# EasyEDA Pro project ProProject_智能车越野组英飞凌主板_2023-12-23.epro, board PCB1_1
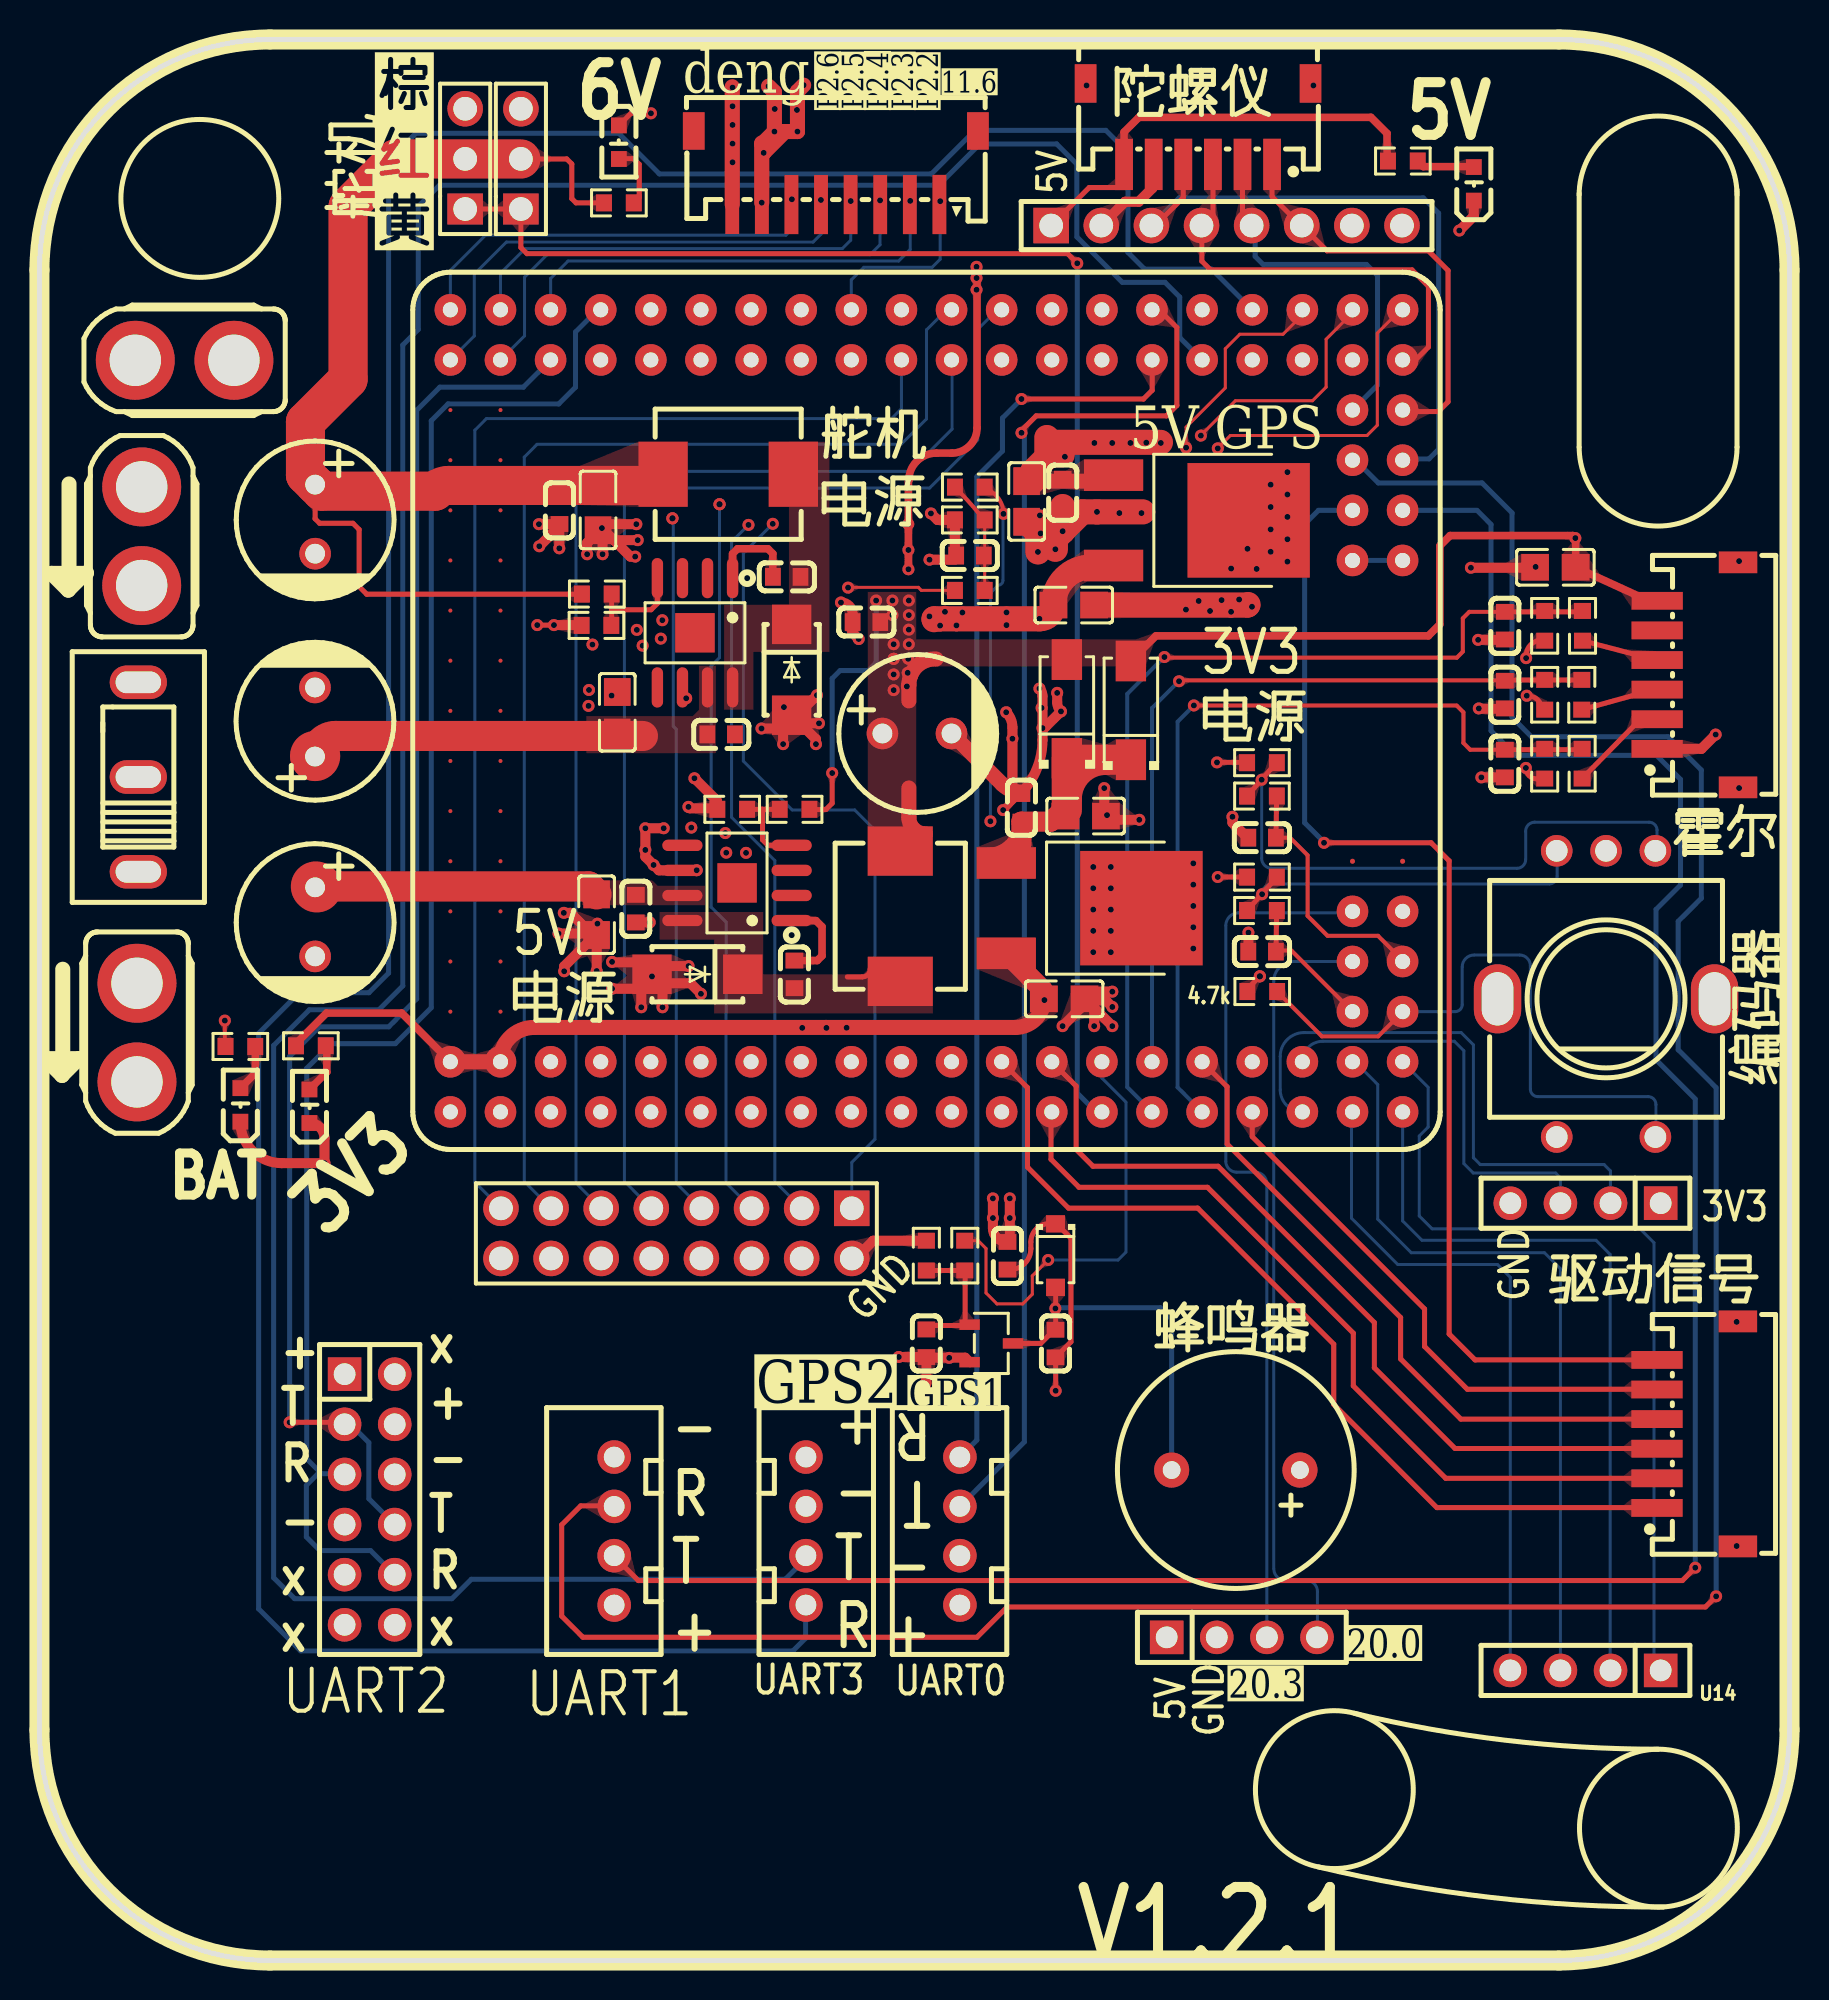
[diagram p4: board, top side]
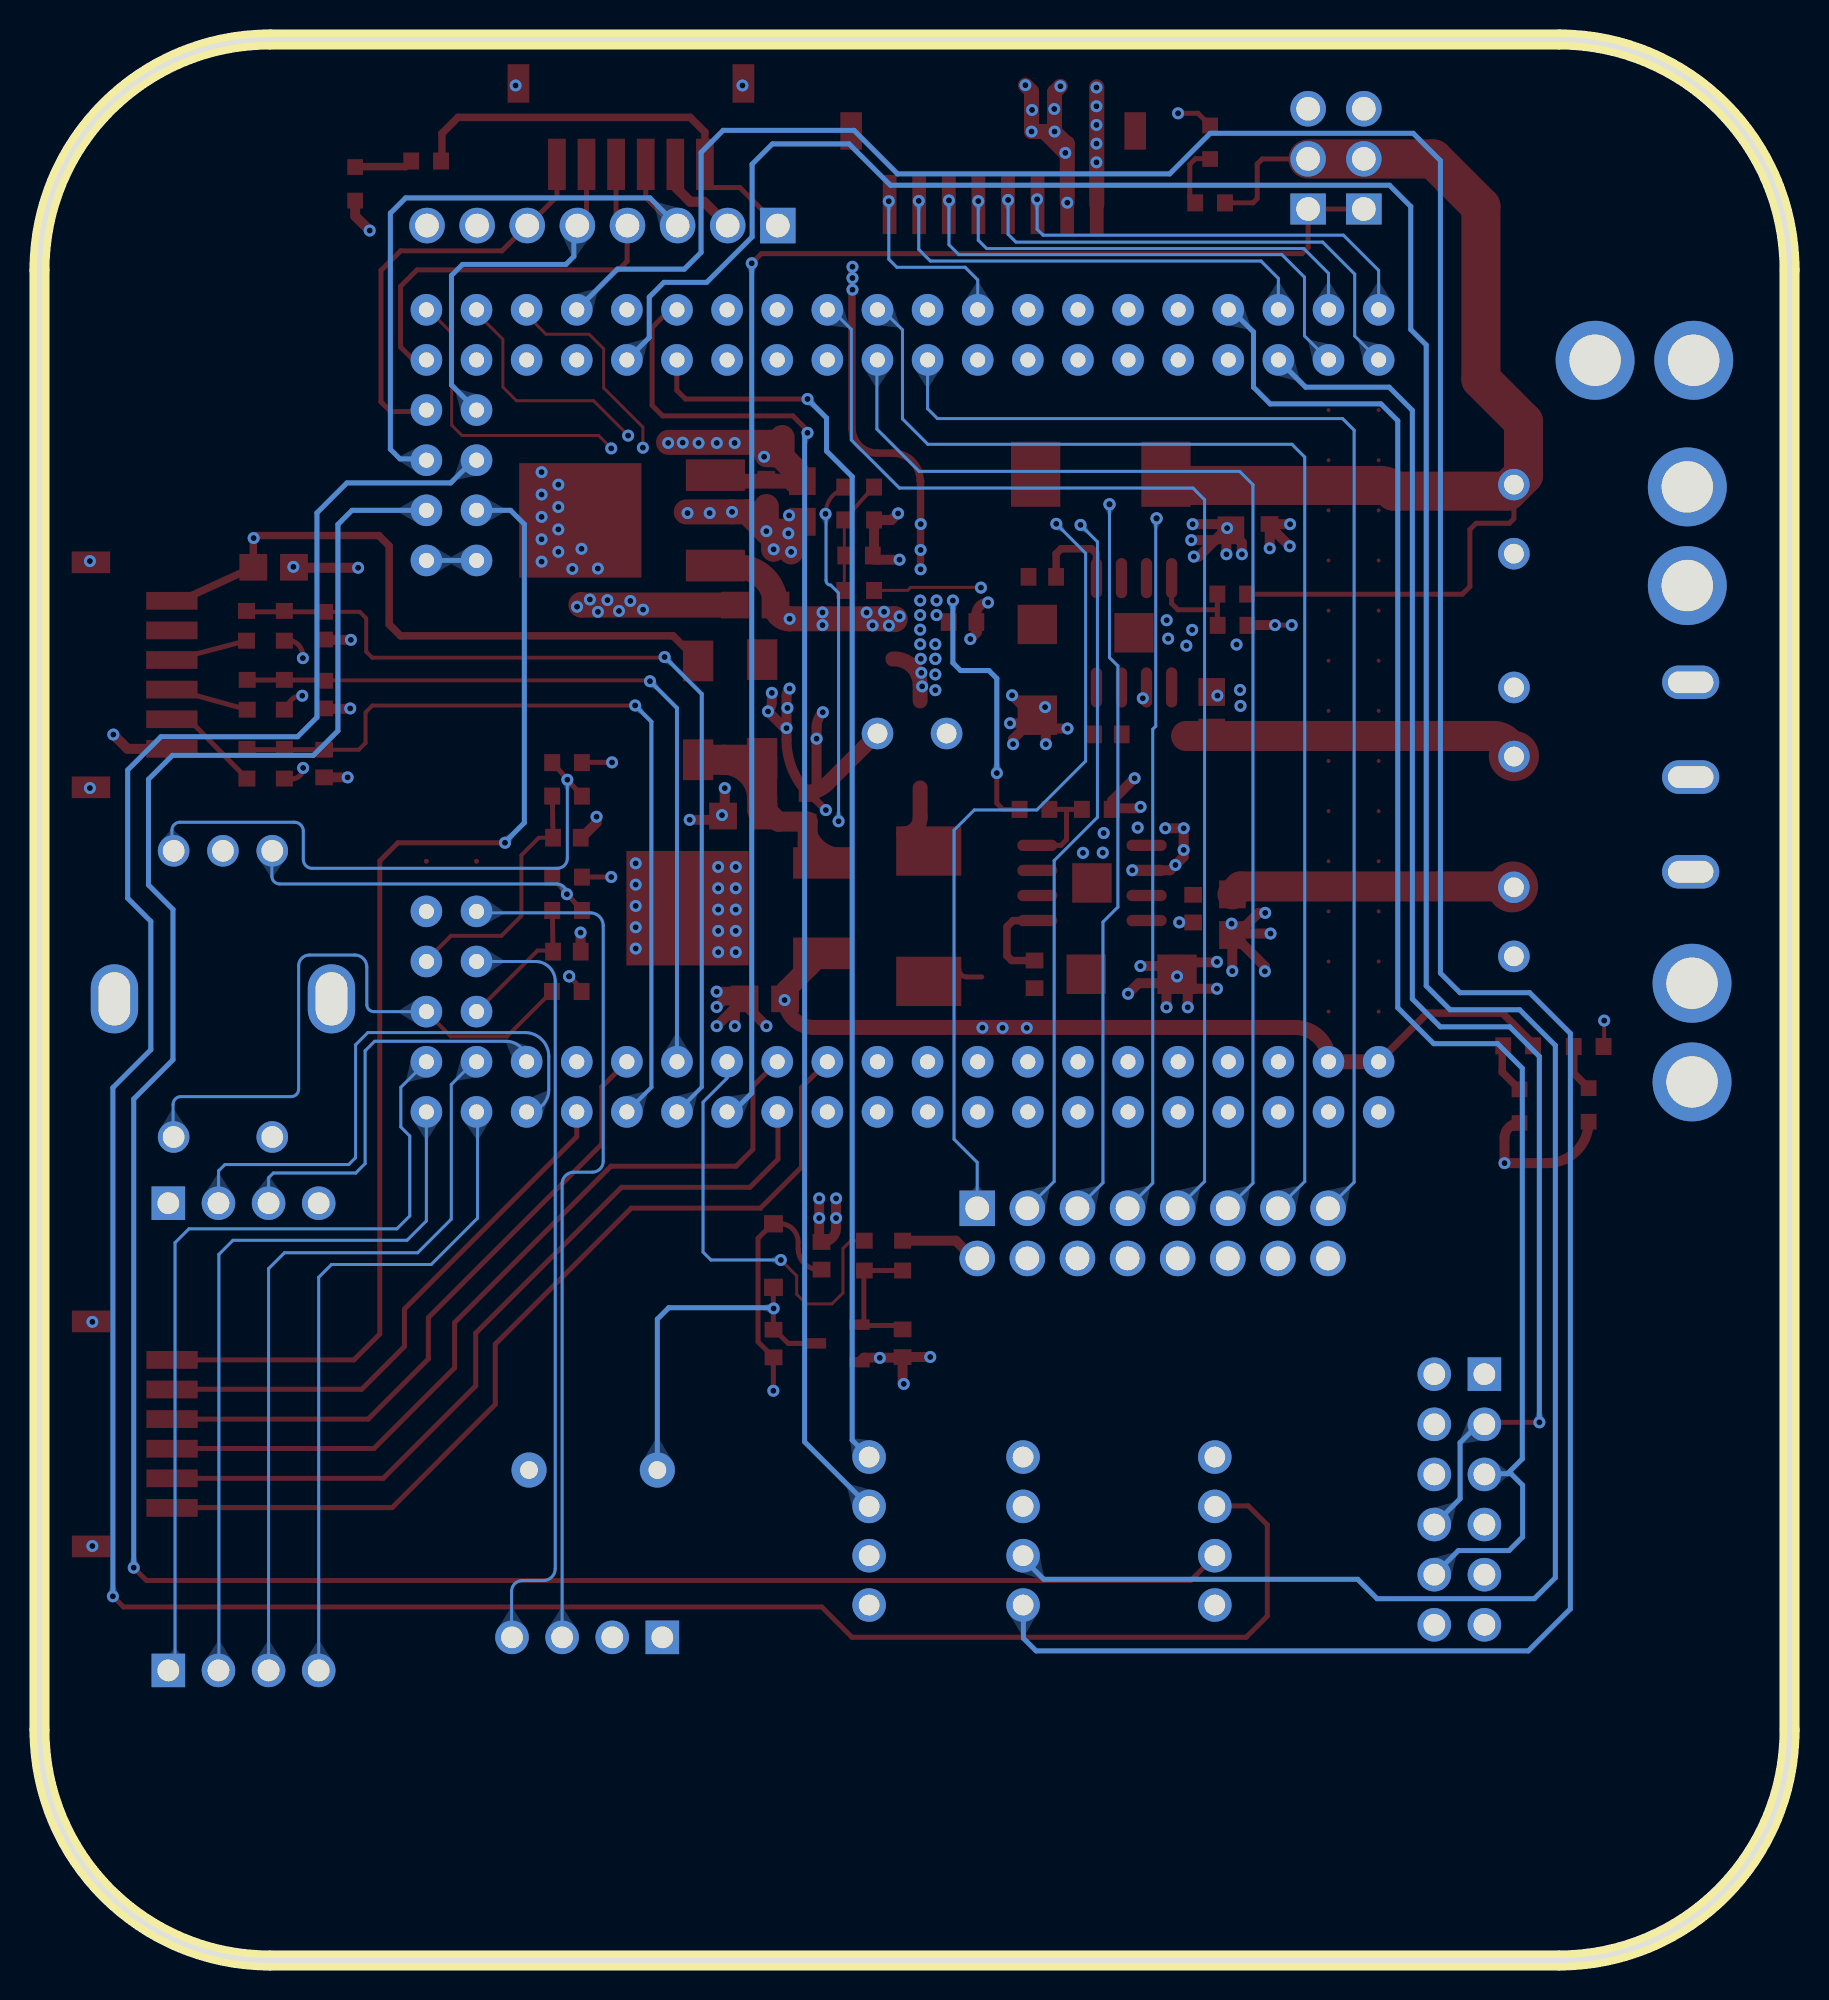
[diagram p5: board, bottom side, seen from below]

Outline 88.69 x 97.33 mm; copper layers: Top Layer, Inner1, Inner2, Bottom Layer. Coordinates in mm from the lower left corner of the outline.
Outline path: 0,85.65 0,11.68 arc(3.42,3.42) 11.68,0 77.01,0 arc(85.27,3.42) 88.69,11.68 88.69,85.65 arc(85.27,93.91) 77.01,97.33 11.68,97.33 arc(3.42,93.91) 0,85.65
Stack: Top Layer 0.035mm / Dielectric1 0.48mm PP er 4.5 / Inner1 0.035mm / Dielectric2 0.48mm FR4 er 4.5 / Inner2 0.035mm / Dielectric3 0.48mm PP er 4.5 / Bottom Layer 0.035mm

## Design rules (mm)
template: 自定义配置
spacing copperThickness1oz (default): track to track 0.102, other pairs 0 to 0.3
spacing copperThickness2oz: track to track 0.203, other pairs 0.152 to 0.3
spacing copperThicknessInner0.5oz: track to track 0.089, other pairs 0.152 to 0.3
track width copperThickness1oz (default): min 0.102, default 0.254, max 2.54
track width copperThickness2oz: min 0.203, default 0.254, max 2.54
track width copperThickness0.5oz: min 0.089, default 0.254, max 2.54
differential pair differentialPair (default): width min 0.127, default 0.254, max 2.54; gap min 0.152, default 0.152
via viaSize (default): diameter min 0.3, default 0.61, max 10; hole min 0.201, default 0.305, max 6.299
pour e3495 uses zhilian
pour e3982 uses zhilian
pour e4006 uses zhilian
pour e199 uses zhilian
pour e201 uses zhilian
pour e1502 uses zhilian
pour e1487 uses zhilian

## Placement (name value [footprint] x y rotation side)
BUZZER1  2048Hz  [BUZ-TH_BD12.0-P6.50-D0.6-FD]  60.63 24.85 180 top
C1  470uF  [CAP-TH_BD8.0-P3.50-D0.6-FD_1]  13.96 62.75 90 top
C2  10uF  [C0805]  28.31 73.5 270 top
C4  10nF  [C0603]  38.26 49.97 90 top
C5  10uF  [C0805]  28.24 52.99 90 top
C6  220uF  [CAP-TH_BD8.0-P3.50-D0.6-FD_1]  44.47 62.17 0 top
C7  100nF  [C0603]  30.23 53.3 90 top
C8  100nF  [C0603]  41.91 67.82 0 top
C9  10uF  [C0805]  53.02 57.99 0 top
C10  100nF  [C0603_1]  49.76 58.4 270 top
C12  470uF  [CAP-TH_BD8.0-P3.50-D0.6-FD_1]  13.97 52.63 270 top
C13  100nF  [C0603]  47.16 71.19 0 top
C14  10nF  [C0603]  61.97 56.89 0 top
C15  100nF  [C0603_2]  51.49 31.26 270 top
C19  10nF  [C0603]  74.27 64.14 90 top
C20  10nF  [C0603]  74.27 60.65 90 top
C22  10nF  [C0603]  37.87 70.11 180 top
C23  10uF  [C0805]  76.83 70.59 180 top
C24  10uF  [C0805]  29.28 63.24 270 top
C30  100nF  [C0603_2]  44.95 31.28 90 top
C31  100nF  [C0603_2]  49.06 35.71 90 top
C33  220uF  [CAP-TH_BD8.0-P3.50-D0.6-FD_1]  13.97 73.03 270 top
C34  100nF  [C0603]  34.55 62.13 180 top
C35  100nF  [C0603]  26.35 73.48 90 top
C38  10nF  [C0603]  61.97 51.12 0 top
C39  10nF  [C0603]  74.27 67.63 90 top
C40  10uF  [C0805]  51.93 48.73 0 top
C41  100nF  [C0603_1]  51.86 74.38 90 top
C42  10uF  [C0805]  50.03 73.93 270 top
C43  10uF  [C0805]  52.42 68.68 0 top
CN1  XT30UPB-F  [CONN-TH_XT30UPB-F]  7.36 81.08 180 top
CN2  KH-ZH1.5WF-06A  [CONN-SMD_KH-ZH1.5WF-06A]  84.04 65.14 90 top
CN4  KH-ZH1.5WF-06A  [CONN-SMD_KH-ZH1.5WF-06A]  84.03 26.68 90 top
CN6  KH-ZH1.5WF-06A  [CONN-SMD_KH-ZH1.5WF-06A]  58.72 93.05 180 top
CN7  XT30UPB-F  [CONN-TH_XT30UPB-F]  5.18 72.17 90 top
CN8  XT30UPB-F  [CONN-TH_XT30UPB-F]  4.94 47.02 270 top
D3  SS34  [DO-214AC_L4.3-W2.7-LS5.3-RD]  33.35 49.97 180 top
D4  SS54  [SMA_L4.4-W2.8-LS5.4-R-RD]  55.31 63.34 90 top
D5  -  [SOD-123_L2.7-W1.6-LS3.7-RD]  51.5 35.72 270 top
D6  SS34  [DO-214AC_L4.3-W2.7-LS5.3-RD]  38.12 65.4 270 top
D9  SS54  [SMA_L4.4-W2.8-LS5.4-R-RD]  52.07 63.41 90 top
H2  icm20602  [HDR-TH_8P-P2.54-V-F-1]  60.16 87.91 0 top
H3  舵机输入  [HDR-TH_3P-P2.54-V-M-1]  24.4 91.28 90 top
H5  舵机输入  [HDR-TH_3P-P2.54-V-M-1]  21.57 91.28 90 top
H6  -  [HDR-TH_16P-P2.54-V-M-R2-C8-S2.54]  32.28 36.84 180 top
H9  2.54-2*6P母  [HDR-TH_12P-P2.54-V-F-R2-C6-S2.54]  16.73 23.36 270 top
H16  -  [HDR-TH_4P-P2.54-V-F]  60.94 16.37 0 top
L1  15uH  [IND-SMD_L7.4-W6.6]  34.91 75.31 0 top
L2  15uH  [IND-SMD_L7.4-W6.6]  43.63 52.91 270 top
LED1  KT-0603R  [LED0603-R-RD]  13.68 43.29 90 top
LED2  KT-0603R  [LED0603-R-RD]  10.18 43.35 90 top
LED3  KT-0603R  [LED0603-R-RD]  29.37 92.13 270 top
LED4  KT-0603R  [LED0603-R-RD]  72.69 90.02 90 top
P1  陀螺仪  [CONN-TH_4P-P2.50-XH2.54-4P]  46.65 21.76 270 top
P2  陀螺仪  [CONN-TH_4P-P2.50-XH2.54-4P]  29.13 21.76 270 top
P3  陀螺仪  [CONN-TH_4P-P2.50-XH2.54-4P]  38.85 21.76 90 top
P5  SMD_ZH1.5MM-8P  [CONN-SMD_8P-P1.50_HCTL_HC-ZH-8PWT]  40.36 90.84 180 top
Q1  -  [SOT-23-3_L3.0-W1.7-P0.95-LS2.9-BR]  48.24 31.27 180 top
R1  10k  [R0603]  61.96 59 180 top
R2  6.8kΩ  [R0603]  38.27 58.33 0 top
R3  10k  [R0603]  13.76 46.35 0 top
R4  10k  [R0603]  10.18 46.31 0 top
R5  10k  [R0603]  29.37 89.06 0 top
R6  10k  [R0603]  69.1 91.18 0 top
R7  10k  [R0603]  61.96 53.2 180 top
R8  6.8kΩ  [R0603]  28.25 69.23 180 top
R9  1.74kΩ  [R0603]  28.23 67.65 0 top
R10  2.2kΩ  [R0603]  35.11 58.33 0 top
R11  10k  [R0603]  61.96 54.89 180 top
R12  10k  [R0603]  61.96 60.69 180 top
R13  47k  [R0603]  47.15 69.42 0 top
R14  10k  [R0603]  47.15 72.99 180 top
R17  10k  [R0603_3]  44.95 35.72 270 top
R18  1k  [R0603_3]  46.9 35.72 270 top
R19  100  [R0603]  47.15 74.65 180 top
R22  4.7k  [R0603]  76.29 67.63 270 top
R23  4.7k  [R0603]  76.29 64.13 270 top
R25  4.7k  [R0603]  76.29 60.64 270 top
R26  100  [R0603]  78.2 67.63 270 top
R27  100  [R0603]  78.17 64.13 270 top
R30  100  [R0603]  78.19 60.64 270 top
R31  0603WAF4701T5E  [R0603]  61.97 49.1 180 top
SW1  EC11L1525E05  [SW-TH_EC11L1525E05]  79.4 48.98 180 top
U1  TC264_CoreBoard  [TC系列V0.2]  73.66 64.21 180 top
U2  LM29150RS-3.3  [TO-252-2_L6.6-W6.1-P4.57-LS9.9-BR-CW]  52.42 53.32 180 top
U3  TPS5430DDAR  [SOIC-8_L5.0-W4.0-P1.27-LS6.0-BL-EP2.0]  35.35 54.6 90 top
U7  TPS5430DDAR  [SOIC-8_L5.0-W4.0-P1.27-LS6.0-BL-EP2.0]  33.22 67.27 180 top
U13  HX SS12D10G4  [SW-TH_SHOU-HAN_SS12D10G4]  5.01 59.96 90 top
U14  -  [5个按键C]  76.83 32.95 270 top
U15  LM29150RS-3.3  [TO-252-2_L6.6-W6.1-P4.57-LS9.9-BR-CW]  57.86 72.97 180 top

## Footprints (pads in the part's own frame, mm; a bottom-side part is the same pattern mirrored in y, then rotated)
5个按键C
  rect 1.7x1.7 hole 1.1: 1(18.253,5.334) 2(-5.42,5.334)
  round 1.7 hole 1.1: 3(-5.42,0.254) 4(18.253,-2.286) 5(-5.42,2.794) 6(18.253,2.794) 7(18.253,0.254) 8(-5.42,-2.286)
BUZ-TH_BD12.0-P6.50-D0.6-FD
  round 1.778 hole 0.899: 1(-3.251,0) 2(3.251,0)
C0603
  rect 0.8x0.9 smd: 1(-0.7,0) 2(0.7,0)
C0603_1
  rect 0.8x0.9 smd: 1(-0.7,0) 2(0.7,0)
C0603_2
  rect 0.8x0.9 smd: 1(-0.7,0) 2(0.7,0)
C0805
  rect 1.409x1.351 smd: 1(-1.028,0) 2(1.031,0)
CAP-TH_BD8.0-P3.50-D0.6-FD_1
  round 1.6 hole 1: 1(-1.75,0) 2(1.75,0)
CONN-SMD_8P-P1.50_HCTL_HC-ZH-8PWT
  rect 0.7x3 smd: 1(-5.25,1.863) 2(-3.75,1.863) 3(-2.25,1.863) 4(-0.75,1.863) 5(0.75,1.863) 6(2.25,1.863) 7(3.75,1.863) 8(5.25,1.863)
  rect 1.1x1.9 smd: 9(7.2,-1.863) 10(-7.2,-1.863)
CONN-SMD_KH-ZH1.5WF-06A
  rect 0.9x2.6 smd: 1(-3.75,2.05) 2(-2.25,2.05) 3(-0.75,2.05) 4(0.75,2.05) 5(2.25,2.05) 6(3.75,2.05)
  rect 1.1x1.95 smd: 7(5.7,-2.05) 8(-5.7,-2.05)
CONN-TH_4P-P2.50-XH2.54-4P
  round 1.7 hole 1.049: 1(3.749,0) 2(1.25,0) 3(-1.25,0) 4(-3.749,0)
CONN-TH_XT30UPB-F
  round 4 hole 2.601: 1(-2.499,0) 2(2.499,0)
DO-214AC_L4.3-W2.7-LS5.3-RD
  rect 1.999x1.999 smd: 1(-2.299,0) 2(2.301,0)
HDR-TH_3P-P2.54-V-M-1
  rect 1.575x1.801 hole 1.199: 1(-2.54,0)
  round 1.801 hole 1.199: 2(0,0) 3(2.54,0)
HDR-TH_4P-P2.54-V-F
  rect 1.7x1.7 hole 1.1: 1(-3.81,0)
  round 1.7 hole 1.1: 2(-1.27,0) 3(1.27,0) 4(3.81,0)
HDR-TH_8P-P2.54-V-F-1
  rect 1.801x1.801 hole 1.199: 1(-8.89,0)
  round 1.801 hole 1.199: 2(-6.35,0) 3(-3.81,0) 4(-1.27,0) 5(1.27,0) 6(3.81,0) 7(6.35,0) 8(8.89,0)
HDR-TH_12P-P2.54-V-F-R2-C6-S2.54
  rect 1.7x1.7 hole 1.1: 1(-6.35,-1.27)
  round 1.7 hole 1.1: 2(-6.35,1.27) 3(-3.81,-1.27) 4(-3.81,1.27) 5(-1.27,-1.27) 6(-1.27,1.27) 7(1.27,-1.27) 8(1.27,1.27) 9(3.81,-1.27) 10(3.81,1.27) 11(6.35,-1.27) 12(6.35,1.27)
HDR-TH_16P-P2.54-V-M-R2-C8-S2.54
  rect 1.8x1.8 hole 1.2: 1(-8.89,-1.27)
  round 1.8 hole 1.2: 2(-8.89,1.27) 3(-6.35,-1.27) 4(-6.35,1.27) 5(-3.81,-1.27) 6(-3.81,1.27) 7(-1.27,-1.27) 8(-1.27,1.27) 9(1.27,-1.27) 10(1.27,1.27) 11(3.81,-1.27) 12(3.81,1.27) 13(6.35,-1.27) 14(6.35,1.27) 15(8.89,-1.27) 16(8.89,1.27)
IND-SMD_L7.4-W6.6
  rect 2.499x3.3 smd: 1(-3.302,0) 2(3.302,0)
LED0603-R-RD
  rect 0.8x0.8 smd: 1(0.851,0) 2(-0.851,0)
R0603
  rect 0.807x0.864 smd: 1(-0.754,0) 2(0.754,0)
R0603_3
  rect 0.807x0.864 smd: 1(-0.754,0) 2(0.754,0)
SMA_L4.4-W2.8-LS5.4-R-RD
  rect 2.062x1.539 smd: 1(2.503,0) 2(-2.503,0)
SOD-123_L2.7-W1.6-LS3.7-RD
  rect 0.879x0.96 smd: 1(-1.611,0) 2(1.611,0)
SOIC-8_L5.0-W4.0-P1.27-LS6.0-BL-EP2.0
  oval 0.574x2.037 smd: 1(-1.905,-2.768) 2(-0.635,-2.768) 3(0.635,-2.768) 4(1.905,-2.768) 5(1.905,2.768) 6(0.635,2.768) 7(-0.635,2.768) 8(-1.905,2.768)
  rect 1.999x1.999 smd: 9(0,0)
SOT-23-3_L3.0-W1.7-P0.95-LS2.9-BR
  rect 1.036x0.531 smd: 1(1.103,-0.95) 2(1.103,0.95) 3(-1.103,0)
SW-TH_EC11L1525E05
  oval 2.4x3.5 hole 1.6x2.7: 6(-5.5,0.25) 7(5.5,0.25)
  round 1.6 hole 1.1: A(-2.5,-7.25) B(2.5,-7.25) C(0,-7.25) D(-2.5,7.25) E(2.5,7.25)
SW-TH_SHOU-HAN_SS12D10G4
  oval 1.7x2.9 hole 1.1x2.3: 1(-4.8,0) 2(0,0) 3(4.8,0)
TC系列V0.2
  round 1.6 hole 0.762: 1(52.832,21.209) 2(52.832,18.669) 3(50.292,21.209) 4(50.292,18.669) 5(47.752,21.209) 6(47.752,18.669) 7(45.212,21.209) 8(45.212,18.669) 9(42.672,21.209) 10(42.672,18.669) 11(40.132,21.209) 12(40.132,18.669) 13(37.592,21.209) 14(37.592,18.669) 15(35.052,21.209) 16(35.052,18.669) 17(32.512,21.209) 18(32.512,18.669) 19(29.972,21.209) 20(29.972,18.669) 21(27.432,21.209) 22(27.432,18.669) 23(24.892,21.209) 24(24.892,18.669) 25(22.352,21.209) 26(22.352,18.669) 27(19.812,21.209) 28(19.812,18.669) 29(17.272,21.209) 30(17.272,18.669) 31(14.732,21.209) 32(14.732,18.669) 33(12.192,21.209) 34(12.192,18.669) 35(9.652,21.209) 36(9.652,18.669) 37(7.112,21.209) 38(7.112,18.669) 39(4.572,21.209) 40(4.572,18.669) 41(4.572,16.129) 42(7.112,16.129) 43(4.572,13.589) 44(7.112,13.589) 45(4.572,11.049) 46(7.112,11.049) 49(7.112,-6.731) 50(4.572,-6.731) 51(7.112,-9.271) 52(4.572,-9.271) 53(7.112,-11.811) 54(4.572,-11.811) 55(7.112,-14.351) 56(4.572,-14.351) 57(4.572,-16.891) 58(4.572,-19.431) 59(7.112,-16.891) 60(7.112,-19.431) 61(9.652,-16.891) 62(9.652,-19.431) 63(12.192,-16.891) 64(12.192,-19.431) 65(14.732,-16.891) 66(14.732,-19.431) 67(17.272,-16.891) 68(17.272,-19.431) 69(19.812,-16.891) 70(19.812,-19.431) 71(22.352,-16.891) 72(22.352,-19.431) 73(24.892,-16.891) 74(24.892,-19.431) 75(27.432,-16.891) 76(27.432,-19.431) 77(29.972,-16.891) 78(29.972,-19.431) 79(32.512,-16.891) 80(32.512,-19.431) 81(35.052,-16.891) 82(35.052,-19.431) 83(37.592,-16.891) 84(37.592,-19.431) 85(40.132,-16.891) 86(40.132,-19.431) 87(42.672,-16.891) 88(42.672,-19.431) 89(45.212,-16.891) 90(45.212,-19.431) 91(47.752,-16.891) 92(47.752,-19.431) 93(50.292,-16.891) 94(50.292,-19.431) 95(52.832,-16.891) 96(52.832,-19.431)
  round 0.254 smd: 47(4.572,8.509) 48(7.112,8.509)
  round 0.203 smd: 97(50.292,-14.351) 98(52.832,-14.351) 99(50.292,-11.811) 100(52.832,-11.811) 101(50.292,-9.271) 102(52.832,-9.271) 103(50.292,-6.731) 104(52.832,-6.731) 105(50.292,-4.191) 106(52.832,-4.191) 107(50.292,-1.651) 108(52.832,-1.651) 109(50.292,0.889) 110(52.832,0.889) 111(50.292,3.429) 112(52.832,3.429) 113(50.292,5.969) 114(52.832,5.969) 115(50.292,8.509) 116(52.832,8.509) 117(50.292,11.049) 118(52.832,11.049) 119(50.292,13.589) 120(52.832,13.589) 121(50.292,16.129) 122(52.832,16.129)
TO-252-2_L6.6-W6.1-P4.57-LS9.9-BR-CW
  rect 3x1.6 smd: 1(3.424,-2.29) 3(3.424,2.29)
  rect 6.2x5.8 smd: 2(-3.424,0)

## Nets
As in the schematic, except:
3V3: C40.1 H6.4 R3.1 R11.2 R12.2 R22.2 R23.2 R25.2 R31.2 U1.2 U1.4 U2.3 U14.2
+5V: BUZZER1.1 C6.1 C8.2 C15.2 C23.1 C31.1 CN2.6 CN6.6 D4.1 D5.1 D9.1 H2.1 H9.1 H9.4 H16.1 L2.1 P2.1 R2.2 R6.1
+6V: C2.1 C33.1 C35.2 H3.2 H5.2 L1.1 R5.1 R8.2
GND: C1.2 C2.2 C5.1 C6.2 C7.1 C8.1 C9.2 C10.1 C12.2 C13.1 C14.1 C19.1 C20.1 C23.2 C24.1 C30.1 C31.2 C33.2 C34.1 C35.1 C38.1 C39.1 C40.2 C41.1 C42.2 C43.2 CN1.2 CN2.1 CN2.7 CN2.8 CN4.7 CN4.8 CN6.5 CN6.7 CN6.8 CN7.2 CN8.2 D3.2 D6.2 H2.2 H3.3 H5.3 H6.2 H9.6 H9.7 H16.2 LED1.2 LED2.2 LED3.2 LED4.2 P1.2 P2.4 P3.2 P5.7 Q1.2 R9.1 R10.1 R14.2 R17.1 SW1.6 SW1.7 SW1.C SW1.E U1.1 U1.3 U2.2 U3.6 U3.9 U7.6 U7.9 U14.8 U15.2
BAT: C41.2 C42.1 CN1.1 CN7.1 U13.2 U15.1
KEY1: U1.36 U14.3
KEY2: U1.37 U14.4
KEY3: U1.35 U14.5
KEY4: U1.39 U14.6
KEY5: U1.38 U14.7
KEY6: U1.40 U14.1

Pads without a net: CN2 5; H2 7 8; H9 2 9 11 12; P5 9 10; U1 5 6 7 8 10 12 14 16 18 21 45 47 48 69 70 71 72 73 88 89 97 98 107 108 109 110 111 112 113 114 115 116 117 118 119 120 121 122; U3 2 3 5; U7 2 3 5; U13 3

## Via types
v1: diameter 0.61, hole 0.305, Top Layer to Bottom Layer, 231 vias

## Routing (per net, layer and track width the routed paths; a pad name or vN(x,y) marks a point on that pad's centre or on a via; arc(x,y) is an arc through that point)
3V3: length 149.7
  Top Layer w0.254: 61.14,60.75 61.1,60.71 v1(59.68,60.71) ; R11.2 61.2,54.9 v1(59.72,54.9) ; 75.35,64.08 75.45,64.08 arc(75.93,63.87) 76.13,63.39 ; 61.23,48.98 61.23,49.25 v1(61.85,49.87) ; v1(39.88,47.25) 39.88,47.28 ; v1(75.35,65.99) 75.35,66.1 arc(75.58,66.67) 76.15,66.91 ; 76.15,59.87 75.89,59.87 arc(75.5,60.03) v1(75.33,60.43)
  Top Layer w0.381: 13.01,46.52 13.07,46.52 14.55,48 18.36,48 U1.2
  Top Layer w0.762: U1.2 23.32,45.54 arc(23.32,45.54) 23.32,45.53 ; 23.34,45.54 arc(23.85,46.77) 25.07,47.28 49.46,47.28 arc(50.48,47.7) C40.1
  Top Layer w1.016: U2.3 50.83,49.2 50.83,48.67
  Inner2 w0.254: 75.35,64.08 v1(75.35,65.99) ; v1(61.85,49.87) 61.38,49.4 60.45,49.4 arc(60.31,49.41) 60.17,49.45 ; 59.69,54.92 59.69,61.61 arc(59.95,62.24) 60.58,62.51 71.15,62.51 ; 59.69,54.92 59.69,50.36 ; 59.69,54.92 arc(59.7,54.91) v1(59.72,54.9) 59.69,54.9 59.69,54.89 ; 59.69,50.36 59.69,50.17 ; 59.69,50.36 arc(59.49,49.88) 59.01,49.68 ; 59.69,50.17 59.69,49.68 ; 59.69,50.17 arc(59.75,49.86) 59.93,49.61 ; 59.69,49.68 59.71,49.68 arc(59.82,49.66) 59.93,49.61 ; 59.69,49.68 59.69,49.36 ; 59.69,49.68 59.01,49.68 ; 74.93,62.49 75.33,62.49 ; 74.93,62.49 74.86,62.49 ; 74.93,62.49 arc(75.21,62.6) 75.33,62.89 ; 75.33,62.49 75.33,62.02 ; 75.33,62.49 75.33,62.89 ; 60.17,49.45 60.14,49.45 arc(59.82,49.32) 59.69,49 ; 60.17,49.45 arc(60.06,49.5) 59.97,49.57 ; 59.69,49.36 59.69,49 ; 59.69,49.36 arc(59.76,49.53) 59.93,49.61 ; 59.69,49 59.69,47.71 arc(59.89,47.2) 60.4,46.99 61.98,46.99 arc(62.52,46.77) 62.75,46.23 62.75,42.18 arc(63.02,41.52) 63.68,41.24 74.76,41.24 arc(75.33,41.13) 75.81,40.81 arc(76.25,40.51) 76.78,40.41 80.11,40.41 arc(81.11,39.99) 81.52,39 ; 59.69,49 arc(59.49,49.48) 59.01,49.68 ; 71.15,62.51 74.86,62.49 ; 71.15,62.51 71.16,62.51 ; 75.33,64.06 75.33,62.89 ; 74.86,62.49 arc(75.2,62.35) 75.33,62.02 ; C40.1 51.86,49.68 59.01,49.68 ; 75.33,62.02 v1(75.33,60.43) ; 59.93,49.61 arc(59.95,49.59) 59.97,49.57 ; 59.93,49.61 arc(59.95,49.59) 59.97,49.57
  Inner2 w0.381: v1(38.66,47.25) 39.18,47.25 ; 39.18,47.25 v1(39.88,47.25) 40.52,47.25 ; 39.18,47.25 arc(39.68,47.05) 39.89,46.55 ; 39.89,46.53 39.89,36.69 arc(39.65,36.1) 39.06,35.86 39,35.86 ; 39.89,46.53 39.89,47.12 ; 39.89,46.53 arc(40.07,47.01) 40.52,47.25 ; 40.52,47.25 40.9,47.25 ; 40.52,47.25 arc(40.57,47.26) 40.62,47.26 v1(40.91,47.26)
  vias: v1(50.93,48.66) v1(75.38,64.08)
+5V: length 295.6
  Top Layer w0.254: 38.95,58.32 39.86,58.32 40.18,58.64 v1(40.18,60.17) ; H2.1 51.3,87.94 53.2,89.83 55.04,89.83 ; 51.67,37.2 52.28,36.59 52.28,31.34 C15.2 arc(51.5,30.56) 51.5,30.55 v1(51.5,28.87) ; C31.1 49.19,35.01 arc(49.94,35.32) 50.25,36.07 50.25,36.4 arc(50.52,37.06) 51.18,37.33
  Top Layer w0.381: v1(44.04,70.49) v1(44.04,71.47) 44.04,74.97 arc(44.05,74.98) 44.06,74.99 arc(44.47,75.97) 45.45,76.38 46.24,76.38 arc(47.14,76.75) 47.52,77.65 47.52,85.89 ; 77.86,72.02 C23.1 81.83,68.77 ; 68.3,91.22 68.3,92.57 67.48,93.39 55.72,93.39 54.97,92.64 CN6.6 ; 51.3,87.94 51.52,87.94 ; v1(77.84,72.07) 77.71,72.2 71.5,72.2 70.97,71.68 70.97,67.7 70.39,67.12 56.59,67.12 D4.1
  Top Layer w0.762: 44.06,59.41 44.06,57.92 arc(44.31,57.33) 44.9,57.08 ; 44.06,63.82 44.06,64.63 arc(44.09,64.88) 44.15,65.12 arc(44.66,65.74) 45.44,65.94
  Inner2 w0.254: 63.89,26.3 63.89,25.3 ; v1(51.5,28.87) 51.5,27.42 arc(51.65,27.07) 51.99,26.93 63.26,26.93 arc(63.7,26.74) 63.89,26.3 arc(63.89,26.3) 63.89,26.3
  Inner2 w0.381: v1(44.04,71.47) 44.04,72.77 arc(44.04,72.78) v1(44.03,72.78) ; v1(44.06,68.91) v1(44.06,68.17) v1(43.23,68.17) ; 44.06,69.74 arc(44.05,69.65) 44.04,69.56 arc(43.75,69.09) v1(43.23,68.91) arc(43.76,69.64) 44.03,70.49 arc(44.03,70.53) 44.04,70.57 arc(44.05,70.74) 44.06,70.91
  Inner2 w0.508: 57.38,18.01 57.38,17.05 ; 57.38,18.01 56.91,18.01 ; 57.38,18.01 57.71,18.01 ; 57.38,17.05 57.38,16.71 ; 57.38,17.05 arc(57.54,17.2) 57.71,17.34 ; 56.91,18.01 55.42,18.01 ; 56.91,18.01 56.91,16.78 ; 57.71,18.01 59.69,18.01 ; 57.71,18.01 57.71,17.34 ; 59.69,18.01 61.98,18.01 arc(63.34,18.58) 63.91,19.94 63.91,24.68 ; 59.69,18.01 arc(58.64,17.84) 57.71,17.34 ; 57.71,17.34 57.71,17.04 ; v1(44.06,66.69) v1(44.06,67.43) arc(43.7,67.52) 43.41,67.75 arc(43.29,67.95) 43.24,68.17 arc(43.23,68.22) 43.23,68.26 v1(43.23,68.91) ; v1(44.04,71.47) v1(44.04,70.49) 44.04,68.93 arc(44.05,68.91) v1(44.06,68.91)
  Inner2 w0.762: 55.42,18.01 arc(55.69,17.99) 55.95,17.92 arc(56.23,17.79) 56.48,17.6 arc(56.74,17.29) 56.91,16.93 arc(56.97,16.69) 56.99,16.45
  Inner2 w1.016: 32.39,17.95 24.63,17.95 arc(23.55,18.39) 23.11,19.47 23.11,25.65 arc(22.66,26.72) 21.58,27.17 ; 32.39,17.95 32.96,17.95 ; 32.39,17.95 arc(34.2,17.7) 35.88,16.98 arc(37.32,16.02) 39.02,15.68 47.7,15.68 arc(49.06,15.95) 50.22,16.72 50.56,17.07 arc(51.6,17.77) 52.84,18.01 54.82,18.01 ; 54.82,18.01 55.21,18.01 ; 54.82,18.01 arc(55.68,17.91) 56.48,17.6 arc(56.7,17.47) 56.91,17.33 arc(57.13,17.16) 57.33,16.97 ; H9.4 18.01,27.17 ; H9.4 H9.1 ; H9.4 21.58,27.17 ; 21.58,27.17 arc(20.55,27.6) 20.12,28.63 ; 55.21,18.01 55.42,18.01 ; 55.21,18.01 arc(55.58,17.99) 55.95,17.92 arc(56.45,17.75) 56.91,17.5 arc(57.15,17.31) 57.38,17.11
  Inner2 w1.27: v1(42.4,68.91) v1(43.23,68.91) v1(44.06,68.91) ; v1(47.49,84.65) v1(47.49,85.25) v1(47.49,85.82) 47.49,86.4 48.97,87.88 51.17,87.88 ; 20.12,27.17 20.12,29.29 ; 40.4,65.48 26.36,65.48 arc(22.04,63.69) 20.25,59.37 20.25,57.22 arc(19.79,54.95) 18.51,53.03 arc(17.22,51.1) 16.77,48.83 16.77,43.57 arc(17.19,41.46) 18.39,39.67 18.93,39.12 arc(19.82,37.46) 20.12,35.6 20.12,30.7 ; 40.4,65.48 41.77,65.48 ; 40.4,65.48 arc(41.88,65.86) 43.01,66.88 arc(43.24,67.3) 43.41,67.75 arc(43.46,67.94) 43.49,68.13 arc(43.49,68.15) 43.5,68.17 arc(43.5,68.2) 43.51,68.24 arc(43.52,68.42) 43.53,68.61 ; 20.12,29.29 20.12,30.7 ; 20.12,29.29 arc(19.5,27.79) H9.4 ; 20.12,30.7 arc(20.5,28.79) 21.58,27.17 ; 41.77,65.48 43.74,65.48 ; 41.77,65.48 arc(42.46,65.34) 43.02,64.92 arc(43.21,64.67) 43.35,64.39
  Bottom Layer w0.254: v1(40.18,60.17) 40.18,64.96 40.58,65.36 42.01,65.36 42.4,65.75 v1(42.4,68.91)
  vias: v1(43.29,66.69) v1(43.29,65.95) v1(43.29,65.95) v1(43.29,65.16) v1(43.29,64.37) v1(44,65.25) v1(43.96,64.56) v1(44.03,65.95)
+6V: length 68.4
  Top Layer w0.254: 24.4,91.28 26.73,91.28 26.98,91.03 26.98,89.27 27.19,89.06 R5.1 ; 27.5,69.23 16.59,69.23 16.2,69.61 16.2,72.5 15.89,72.82 14.2,72.82 13.97,73.05 C33.1 13.45,74.26
  Top Layer w1.981: 24.4,91.28 18.05,91.28 15.64,88.87 15.64,80.12 13.48,77.96 13.48,75.27 C33.1 14.3,74.45 20.05,74.45 arc(20.37,74.66) 20.74,74.74 31.59,74.74 arc(31.66,74.75) 31.73,74.79
GND: length 162.1
  Top Layer w0.254: v1(30.99,93.59) 29.98,93.59 LED3.2 ; v1(26.08,67.66) v1(25.23,67.66) ; 49.75,59.16 arc(49.73,59.13) 49.7,59.1
  Top Layer w0.381: 49.85,59.16 49.71,59.16 v1(48.84,58.29)
  Top Layer w0.508: v1(33.53,48.98) 32.99,49.52 31.58,49.52 ; 38.55,62.69 39.35,61.88 v1(39.35,61.63) ; 38.55,62.69 37.93,62.69 ; 38.55,62.69 v1(37.73,63.51) 38.8,63.51 v1(39.4,64.11) ; 38.55,62.69 v1(39.51,62.69) ; v1(53.45,47.34) 53.45,48.26 ; 53.45,48.26 53.08,48.64 ; 53.45,48.26 53.45,48.64 ; 53.45,48.26 v1(54.37,47.34) ; v1(84.95,62.12) 84.23,61.39 CN2.1 ; v1(49.18,38.61) v1(49.18,37.62) 49.18,36.49 ; 31.58,49.52 31.58,50.39 ; 31.58,49.52 v1(31.58,48.3) ; 31.58,49.52 30.7,49.52 ; 31.58,50.39 31.58,50.42 ; 31.58,50.39 30.58,50.39 ; 31.58,50.39 v1(32.9,50.39) ; 28.11,51.89 28.18,51.96 ; 28.11,51.89 28.12,51.87 ; 28.11,51.89 27.96,52.04 ; 28.11,51.89 26.59,50.37 v1(26.59,50.12) ; 53.08,48.64 53.45,48.64 ; 53.08,48.64 53.07,48.64 ; 53.08,48.64 53.07,48.64 ; 74.32,63.42 72.97,63.42 v1(72.95,63.44) ; 53.45,48.64 53.45,48.71 ; 53.45,48.64 54.05,48.64 v1(54.37,48.32) ; 46.38,71.21 46.4,71.23 R14.2 45.51,72.99 v1(45.18,73.32) ; 26.26,72.78 26.26,72.8 ; 26.26,72.78 26.26,72.59 v1(25.33,71.66) ; 26.26,72.78 26.35,72.78 ; 26.26,72.78 v1(25.31,72.78) ; v1(41.52,66.96) 41.19,67.29 ; v1(72.91,66.92) 74.3,66.92 ; v1(33.19,59.9) 34.33,58.77 34.33,58.25 ; LED4.2 72.69,88.39 v1(71.96,87.65) ; 32.73,55.24 31.4,55.24 v1(31.12,55.51) 30.71,55.93 v1(30.71,56.27) v1(30.71,57.37) v1(31.64,57.37) ; Q1.2 46.91,30.54 45.02,30.54 ; v1(30.19,71.13) 29.95,71.13 29.12,71.97 ; v1(28.24,50.13) 28.24,51.85 ; v1(28.54,71.25) 28.54,72.54 ; 28.54,72.54 29.12,71.97 ; 28.54,72.54 v1(28.5,72.58) ; v1(54.37,49.09) 52.97,49.09 ; 53.07,48.78 53.07,48.64 ; 53.07,48.64 53,48.72 ; 53.07,48.64 53.07,48.64 ; v1(55.74,57.8) 54.02,57.8 ; v1(61.27,52.08) 61.27,51.12 C38.1 ; v1(26.08,67.66) 27.37,67.66 ; 56.41,91.21 56.41,89.8 55.71,89.11 55.02,89.11 H2.2 ; v1(30.93,52.6) 30.12,52.6 ; 37.69,62.42 38.29,62.42 ; 37.69,62.42 37.69,62.81 ; 37.69,62.42 v1(36.59,62.42) ; 37.69,62.42 v1(37.69,61.63) ; v1(27.76,71.25) 27.76,71.83 v1(28.5,72.58) ; 41.2,35.42 42.25,36.47 R17.1 ; v1(60.46,57.95) 60.46,57.65 61.18,56.94 ; 27.96,52.04 26.91,53.08 v1(26.57,53.08) ; 27.96,52.04 v1(26.31,52.04) ; 27.96,52.04 28.04,52.04 ; v1(29.02,50.6) 29.04,50.58 30.8,50.58 ; 53.07,48.64 53.07,48.56 v1(51.85,47.34) ; 53.07,48.64 52.98,48.64 ; 49.31,59.15 v1(49.31,61.91) 49.31,62.48 arc(49.23,62.9) v1(48.99,63.25) ; v1(28.5,72.58) 28.7,72.78 v1(30.25,72.78) ; 26.35,72.78 26.43,72.78 ; 26.35,72.78 v1(26.35,71.55) ; v1(29.02,49.24) 30.5,49.24 ; 30.5,49.24 30.76,49.24 ; 30.5,49.24 30.5,50.47 ; 30.5,49.24 v1(30.5,48.3) ; v1(72.55,70.57) 75.78,70.57 v1(75.83,70.61) ; C20.1 73.08,59.95 ; C30.1 44.95,29.28 v1(44.89,29.22) ; 29.12,71.97 v1(30.32,71.97) ; v1(53.96,59.4) 53.96,57.9 ; v1(43.55,30.58) 44.84,30.58 ; v1(50.83,62.44) 50.83,64.08 arc(50.79,64.28) v1(50.68,64.45) ; v1(50.83,62.44) 50.83,61.84 arc(50.55,60.39) 49.75,59.16 ; v1(50.83,62.44) arc(50.92,62.46) 50.99,62.51 v1(51.77,63.29) arc(51.63,63.5) 51.58,63.75 v1(51.58,64.23) ; v1(48.32,38.61) v1(48.32,37.62) 48.32,37.11 arc(48.53,36.61) 49.02,36.41 ; 34.26,58.38 32.96,58.38 arc(32.91,58.4) v1(32.89,58.45) ; 41.21,67.29 C8.1 41.21,68.21 arc(41.04,68.63) v1(40.62,68.81) ; P5.7 36.67,89.03 ; 38.32,92.77 v1(38.42,92.67) ; v1(45.11,70.98) 46.41,70.98 ; LED1.2 arc(14.22,42.21) 14.45,41.67 v1(14.45,40.4) 12.28,40.4 arc(10.8,41.02) LED2.2
  Top Layer w0.762: 37.78,92.67 v1(36.7,91.59) 36.67,91.55 ; 37.78,92.67 v1(38.42,92.67) 38.42,94.71 v1(38.73,95.02) ; 37.78,92.67 v1(37.25,92.67) ; 36.61,92.03 v1(37.25,92.67) ; 36.61,92.03 36.61,92.09 ; 36.61,92.03 v1(36.61,89.07) ; v1(37.25,92.67) 37.25,94.67 v1(36.95,94.96) ; C6.2 48.79,59.6 arc(49.03,59.41) 49.31,59.28 arc(49.52,59.23) 49.74,59.21
  Top Layer w1.27: v1(51.86,72.42) 51.49,72.05 v1(51.49,71.5) ; v1(51.86,72.42) 51.86,73.67 ; v1(51.86,72.42) 50.51,72.42 C42.2 ; v1(51.86,72.42) 52.84,73.4 v1(53.59,73.4) 55.92,73.4 ; v1(50.6,71.37) 50.6,72.3 ; 61.25,68.7 61.23,68.68 C43.2
  vias: v1(27.85,64.38) v1(27.83,63.57) v1(28.03,66.68) v1(28.28,52.54) v1(29,64.09) v1(30.28,67.42) v1(30.57,66.62) v1(31.04,49.86) v1(31.49,66.98) v1(31.57,67.91) v1(32.78,63.95) v1(33.04,57.4) v1(33.31,55.24) v1(34.76,57.12) v1(34.81,56.13) v1(35.81,56.12) v1(37.26,93.81) v1(38.39,93.76) v1(46.11,30.53) v1(50.7,73.22) v1(50.74,72.31) v1(50.79,63.47) v1(53.07,95) v1(53.41,55.41) v1(53.41,54.33) v1(53.41,53.25) v1(53.41,52.17) v1(53.41,51.09) v1(54.1,58.03) v1(54.3,55.41) v1(54.3,54.33) v1(54.3,53.25) v1(54.3,52.17) v1(54.3,51.09) v1(54.73,73.34) v1(55.85,73.34) v1(58.1,68.45) v1(58.48,55.59) v1(58.48,54.51) v1(58.48,53.43) v1(58.48,52.35) v1(58.48,51.27) v1(58.75,68.89) v1(59.33,68.38) v1(59.91,68.93) v1(60.4,70.53) v1(60.39,68.33) v1(60.8,68.96) v1(61.22,71.53) v1(61.45,68.59) v1(61.69,70.51) v1(62.4,74.78) v1(62.4,73.64) v1(62.4,72.51) v1(62.4,71.38) v1(63.25,75.41) v1(63.25,74.28) v1(63.25,73.15) v1(63.25,72.01) v1(63.25,70.88) v1(64.57,95) v1(73.08,59.95) v1(86.01,32.36) v1(86.01,21) v1(86.14,70.9) v1(86.14,59.41)
VCC: length 125.6
  Top Layer w0.152: v1(40.98,69.56) 40.99,69.57 44.54,69.57 44.69,69.42 46.51,69.42
  Top Layer w0.203: v1(9.39,47.62) 9.39,46.34 R4.1
  Top Layer w0.762: P5.8 35.11,94.94
  Top Layer w1.524: 30.58,62.05 15.01,62.05 arc(14.28,61.75) 13.97,61.03 arc(13.97,61.02) 13.97,61.01 ; 13.97,54.38 14.01,54.42 14.02,54.42 27.83,54.42 C5.2
  Top Layer w2.54: 14.01,54.42 14.06,54.37 ; 13.97,61.03 13.97,61.03
  Inner2 w0.508: v1(40.98,69.56) 17.05,69.56
  Inner2 w0.762: 35.13,88.39 v1(35.13,91.11) v1(35.13,92.06) v1(35.13,93) v1(35.13,93.95) v1(35.13,94.9) ; 35.13,88.39 35.13,86.58 arc(35.11,86.41) 35.07,86.24 arc(34.66,85.67) 34,85.45 ; 35.13,88.39 arc(34.45,86.75) 32.82,86.08 ; 17.63,83.33 arc(17.62,83.21) 17.62,83.09
  Inner2 w2.032: 35.07,86.24 34.91,86.08 19.78,86.08 17.05,83.36 17.05,64.79 ; 17.05,64.79 17.05,63.12 ; 17.05,64.79 arc(16.37,63.13) 14.71,62.45
ADC_BAT: length 33.6
  Top Layer w0.203: v1(48.86,73.3) arc(48.6,74.09) 47.93,74.57
  Inner2 w0.152: U1.20 43.69,46.93 44.16,47.41 47.39,47.41 48.2,48.22 v1(48.2,57.72)
  Bottom Layer w0.152: v1(48.2,57.72) 48.2,69.29 48.59,69.69 arc(48.76,69.76) 48.83,69.93 48.83,73.37
BAT: length 64.2
  Top Layer w0.762: 54.47,74.99 54.44,74.96 50.35,74.96
  Top Layer w1.27: 51.06,77.17 51.06,76.39 ; 50.09,74.96 50.35,74.96 50.35,75.45 51.19,76.29 51.83,76.29 ; 56.81,76.92 51.16,76.92
  Inner1 w1.27: v1(56.83,76.89) 56.82,76.91 v1(56.09,76.91) 55.31,76.91 v1(55.29,76.89) v1(54.37,76.89) arc(53.93,76.86) 53.49,76.78 arc(52.74,76.5) 52.08,76.06 arc(51.95,75.95) 51.83,75.84 51.58,75.59 arc(51.11,75.17) 50.5,75.02 47.56,75.02 arc(46.72,75.37) 46.38,76.2 arc(45.94,77.27) 44.87,77.71 13.22,77.71 arc(10.84,78.7) CN1.1
  vias: v1(51.97,76.19) v1(53.46,76.89)
BEEP: length 22.6
  Top Layer w0.152: v1(51.12,35.49) 50.32,34.69 50.32,33.76 49.83,33.27 48.53,33.27 47.97,33.83 47.97,36.08 47.58,36.47 R18.1
  Bottom Layer w0.152: U1.28 53.85,44.71 55.06,43.49 55.06,35.89 54.66,35.49 v1(51.12,35.49)
CAM_PCLK: length 72.9
  Top Layer w0.254: v1(12.68,27.27) 15.53,27.27 15.56,27.23
  Bottom Layer w0.254: v1(12.68,27.27) 12.68,45.81 14.18,47.31 17.7,47.31 19.12,48.72 19.12,78.55 20.29,79.72 24.52,79.72 U1.91 ; H9.8 16.7,23.4 16.7,26.24 15.65,27.29
CAM_VSY: length 80.4
  Bottom Layer w0.254: 14.29,24.67 15.27,24.67 ; 14.29,24.67 13.54,25.42 13.54,45.21 14.79,46.45 18.03,46.45 19.86,48.28 19.86,78.02 20.71,78.87 26.32,78.87 27.17,79.72 27.17,82.51 28.24,83.59 ; 14.29,24.67 14.11,24.67 13.53,24.08 13.53,21.46 14.22,20.77 16.78,20.77 H9.10
D0: length 49.3
  Inner2 w0.152: v1(37.16,72.79) 37.16,77.34 38.44,78.62 38.44,81.19
  Bottom Layer w0.152: H6.1 41.17,40.44 42.34,41.61 42.34,57.27 41.32,58.3 38.15,58.3 35.67,60.77 35.67,71.3 v1(37.16,72.79)
D1: length 48
  Inner2 w0.152: v1(35.93,72.74) 35.93,78.01 37.37,79.45 37.37,82.44 38.24,83.31
  Bottom Layer w0.152: v1(35.93,72.74) 35.08,71.88 35.08,57.92 37.27,55.73 37.27,39.47 H6.3
D2: length 44.4
  Inner2 w0.152: v1(34.47,73.78) 34.47,79.34 35.97,80.84
  Bottom Layer w0.152: H6.5 34.79,39.41 34.79,52.62 34.04,53.38 34.04,65.59 34.47,66.02 v1(34.47,73.78)
D3: length 49.2
  Inner2 w0.152: v1(32.08,73.07) 32.08,81.9 32.61,82.42 35.44,82.42 35.96,82.94 35.96,83.42
  Bottom Layer w0.152: v1(32.08,73.07) 32.12,73.03 32.12,62.54 32.27,62.39 32.27,39.39 H6.7
D4: length 62.4
  Bottom Layer w0.152: 48.37,83.47 47.55,82.64 47.55,77.04 45.11,74.61 30.23,74.61 29.65,74.02 29.65,39.48 H6.9
D5: length 60.9
  Bottom Layer w0.152: H6.11 27.19,39.39 27.19,74.78 27.87,75.45 44.11,75.45 46.25,77.6 46.25,81.1
D6: length 65.6
  Bottom Layer w0.152: H6.13 24.57,39.47 24.57,76.18 25.22,76.82 43.67,76.82 44.96,78.11 44.96,82.62 45.82,83.49
D7: length 64.6
  Bottom Layer w0.152: 43.69,81.19 43.69,78.63 43.19,78.13 22.65,78.13 22.07,77.54 22.07,39.43 H6.15
EC11_A: length 12.9
  Top Layer w0.203: 62.67,56.89 63.38,56.89 64.27,56 64.27,52.93 65.28,51.92 67.84,51.92 68.92,50.84
  Top Layer w0.254: 62.7,59 62.67,56.89 62.67,56.69
  Top Layer w0.381: C14.2 62.67,56.89 C14.2
EC11_B: length 7.5
  Top Layer w0.203: 62.68,51.17 63.45,51.17 U1.42
  Top Layer w0.254: 62.67,50.89 62.7,53.21
GPIO1: length 41.1
  Top Layer w0.254: CN4.2 71.27,24.43 66.59,29.12 66.59,31.79 59.2,39.18 52.69,39.18 51.27,40.6 51.27,42.68
GPIO2: length 33.5
  Top Layer w0.254: CN4.4 72.03,27.43 68.98,30.48 68.98,32.58 60.19,41.37 60.19,44.27 U1.32
GPIO3: length 61.1
  Top Layer w0.254: v1(65.1,56.63) 70.53,56.63 71.45,55.72 71.45,31.74 72.76,30.43 CN4.6
  Bottom Layer w0.254: U1.51 64.82,73.48 64.12,72.78 64.12,57.65 65.14,56.63 65.11,56.63 v1(65.1,56.63)
GPIOIN: length 2.6
  Bottom Layer w0.254: U1.49 69.09,70.94 69.1,70.95
GPS: length 119.3
  Top Layer w1.27: 54.72,70.61 53.33,70.61 arc(51.96,70.05) C43.1 arc(51.19,68.18) 50.69,67.98 45.34,67.98 45.34,67.94
  Inner2 w1.27: 48.86,67.66 46.51,67.66 arc(46.49,67.66) v1(46.47,67.65) ; 48.86,67.66 v1(49.01,67.66) ; 48.86,67.66 arc(47.46,66.91) 46.34,65.79 arc(46.15,65.52) 45.96,65.26 ; 48.86,67.66 arc(48.93,67.69) 49,67.71 arc(49.08,67.74) 49.17,67.76 arc(49.92,67.92) v1(50.68,67.98) 45.44,67.98 ; 40.45,25.51 P3.1 38.7,25.51 ; 40.45,25.51 arc(42.21,24.78) 42.94,23.02 42.94,21.65 arc(44,19.08) 46.57,18.01 ; 40.45,25.51 arc(39.69,25.58) 38.95,25.78 arc(38.11,26.2) 37.39,26.78 ; 45.96,65.26 45.96,66.87 arc(45.88,67.29) v1(45.65,67.64) ; 45.96,65.26 arc(45.22,64.05) 44.58,62.79 arc(44.33,61.54) 43.63,60.49 41.8,58.67 arc(41.12,57.64) 40.87,56.42 arc(40.58,54.94) 39.74,53.68 39.4,53.34 arc(38.76,52.91) 38,52.76 34.65,52.76 29.99,54.03 27.55,54.48 25.51,54.48 arc(22.89,53.96) 20.67,52.48 20.6,52.41 arc(19.01,50.04) 18.46,47.25 18.46,44.09 ; 37.39,26.78 38.7,25.47 ; 37.39,26.78 37.32,26.85 arc(35.76,27.89) 33.93,28.25 27.03,28.25 arc(23.22,30.12) 21.68,34.08 21.68,36.9 arc(21.54,37.91) 21.16,38.86 20.23,40.48 arc(19.04,42.14) 18.46,44.09 ; 18.46,44.09 arc(18.41,44.87) 18.46,45.65
  vias: v1(45.1,68.1) v1(45.89,68.34) v1(46.78,68.3) v1(49.01,68.3)
GPS1_RX: length 63
  Top Layer w0.254: 56.4,80.81 56.4,79.56 55.95,79.12 v1(49.77,79.12)
  Bottom Layer w0.254: P1.4 47.51,26.37 47.51,75.18 48.81,76.48 48.81,78.15 v1(49.77,79.12)
GPS1_TX: length 69.5
  Top Layer w0.254: 56.8,83.59 57.65,82.74 57.65,78.79 57.12,78.26 50.51,78.26 49.77,77.52 v1(49.77,77.4)
  Bottom Layer w0.254: P1.3 49.92,26.28 49.92,77.26 v1(49.77,77.4)
GPS2_RX: length 161.7
  Bottom Layer w0.254: 38.83,18.12 38.83,16.33 38.19,15.69 13.24,15.69 11.11,17.82 11.11,46.97 13.17,49.04 16.7,49.04 17.69,50.03 17.69,91.2 19.07,92.58 29.36,92.58 31.42,90.52 45.21,90.52 47.41,92.73 54.04,92.73 55.16,91.61 55.16,86.55 56.01,85.7 59.41,85.7 U1.64
GPS2_TX: length 151.6
  Bottom Layer w0.254: U1.65 57.79,82.23 57.79,84.28 57.05,85.03 54.88,85.03 52.58,87.33 52.58,91.01 51.55,92.04 47.66,92.04 45.57,89.95 20.27,89.95 19.2,88.87 19.2,82.64 18.41,81.86 18.41,49.38 17.2,48.17 13.68,48.17 11.87,46.36 11.87,19.39 12.93,18.33 20.9,18.33 21.89,19.32 37.8,19.32 38.72,20.24
HALL_A: length 47.6
  Top Layer w0.203: v1(57.01,66.04) 57.05,66.01 71.83,66.01 72.14,66.32 72.14,68.01 72.47,68.33 C39.2
  Top Layer w0.254: C39.2 78.2,68.33 arc(78.25,68.35) 78.27,68.4
  Bottom Layer w0.203: v1(57.01,66.04) 57,66.04 55.13,64.17 55.13,44.25 U1.29
HALL_B: length 40.4
  Top Layer w0.203: C19.2 74.25,64.86 57.79,64.86 57.75,64.83
  Top Layer w0.254: 78.22,64.88 74.31,64.88 arc(74.28,64.87) C19.2
  Bottom Layer w0.203: U1.30 56.39,63.46 57.75,64.83
  vias: v1(57.75,64.82)
HALL_C: length 43
  Top Layer w0.203: 58.51,63.59 58.51,63.59 71.82,63.59 72.17,63.24 72.17,61.69 72.51,61.35 C20.2
  Top Layer w0.254: C20.2 78.11,61.35 arc(78.16,61.37) 78.18,61.41
  Bottom Layer w0.203: v1(58.51,63.59) 57.68,62.77 57.68,44.24 U1.31
KEY1: length 21.2
  Bottom Layer w0.152: U14.3 77.08,39.66 76.84,39.9 72.67,39.9 72.19,40.38 72.19,46.1 71.71,46.58 65.04,46.58 arc(64.31,46.27) U1.36
KEY2: length 34.1
  Bottom Layer w0.152: U14.4 74.54,34.62 73.89,35.27 68.84,35.27 66.49,37.61 66.49,42.55
KEY3: length 28.7
  Bottom Layer w0.152: 79.62,38.41 79.62,40.01 79.29,40.33 73.02,40.33 72.67,40.68 72.67,46.4 72.05,47.02 64.09,47.02 arc(63.24,46.66) 62.88,45.81 62.88,44.12 arc(63.21,43.33) U1.35
KEY4: length 37.9
  Bottom Layer w0.152: 79.6,14.65 79.6,35.77 78.88,36.49 70.07,36.49 69.09,37.47 U1.39
KEY5: length 38.9
  Bottom Layer w0.152: U14.7 77.08,35.05 76.28,35.86 69.53,35.86 67.82,37.56 67.82,44.38 66.83,45.38
KEY6: length 42.8
  Bottom Layer w0.152: U1.40 70.38,44.24 70.38,42.23 69.93,41.78 69.93,37.73 70.58,37.07 81.12,37.07 81.82,36.37 81.82,15.09 82.23,14.68
KEY_EC11: length 31.9
  Top Layer w0.203: 69.08,48.06 67.85,46.82 65,46.82 R31.1
  Bottom Layer w0.152: U1.41 71.75,48.08 arc(72,48.18) 72.11,48.44 72.11,50.34 arc(72.28,50.77) 72.71,50.95 75.01,50.95 arc(75.4,50.79) 75.56,50.4 75.56,44.15 arc(75.67,43.88) 75.94,43.77 81.53,43.77 arc(81.81,43.66) 81.92,43.38 81.92,41.85 arc(81.98,41.71) 82.11,41.66
P02.2: length 22.9
  Bottom Layer w0.152: U1.92 25.91,85.23 26.79,86.11 43.54,86.11 44.13,86.7 v1(44.13,89.16)
P02.3: length 25.6
  Bottom Layer w0.152: v1(42.6,89.18) 42.6,86.94 42.1,86.43 25.73,86.43 24.58,85.29 24.58,82.32 U1.93
P02.4: length 22.3
  Bottom Layer w0.152: U1.94 23.37,85.49 24.62,86.74 40.69,86.74 41.12,87.17 v1(41.12,89.15)
P02.5: length 25
  Bottom Layer w0.152: v1(39.6,89.2) 39.6,87.46 39.21,87.07 23.66,87.07 22.04,85.45 22.04,82.31 U1.95
P02.6: length 21.7
  Bottom Layer w0.152: v1(38.13,89.24) 38.13,87.72 37.83,87.42 22.61,87.42 20.83,85.64 U1.96
P11.6: length 9.4
  Bottom Layer w0.152: v1(45.65,89.14) 45.65,86.2 45.24,85.79 41.78,85.79 41.15,85.15 U1.80
P20.0: length 40.2
  Bottom Layer w0.152: U1.44 63.56,50.62 arc(62.85,50.32) 62.55,49.61 62.55,19.86 arc(62.73,19.43) 63.16,19.25 64.22,19.25 arc(64.61,19.09) 64.77,18.7 64.77,15.72
P20.3: length 44.5
  Bottom Layer w0.152: 66.57,53.08 60.78,53.08 arc(60.32,52.89) 60.12,52.43 60.12,40.5 arc(60.29,40.11) 60.68,39.94 61.62,39.94 arc(62.03,39.77) 62.21,39.35 H16.3
PWM1: length 46.6
  Top Layer w0.254: U1.24 50.08,44.23 50.08,40.2 52.15,38.12 58.7,38.12 65.59,31.23 65.59,28.17 70.82,22.95 81.87,22.95
PWM2: length 41.2
  Top Layer w0.254: 81.2,25.94 71.74,25.94 67.65,30.03 67.65,32.32 59.73,40.24 53.39,40.24 52.54,41.09 52.54,44.3 U1.26
PWM3: length 27.5
  Top Layer w0.254: 81.29,28.94 72.36,28.94 70.2,31.11 70.2,33.01 61.47,41.74 U1.33
PWM_SERVO: length 76.5
  Top Layer w0.254: H3.1 24.4,86.79 24.71,86.48 52.11,86.48 v1(52.6,86) ; H5.1 24.37,88.74 arc(24.38,88.75) 24.39,88.76
  Bottom Layer w0.254: v1(52.6,86) 52.6,43.95 53.44,43.1
RX_3: length 140.9
  Top Layer w0.254: 29.12,23.04 27.43,23.04 26.47,22.07 26.47,17.45 27.54,16.38 47.51,16.38 49.05,17.91 84.44,17.91 v1(84.97,18.45)
  Bottom Layer w0.254: U1.53 66.7,76.02 67.85,74.87 73.12,74.87 74.63,73.35 74.63,62.99 75.62,62.01 82.54,62.01 84.22,60.32 84.22,53.82 83.05,52.65 83.05,46.15 84.97,44.22 v1(84.97,18.45)
SPI_CS_PIN: length 21
  Top Layer w0.254: H2.6 65.26,86.62 70.39,86.62 71.39,85.63 71.39,78.98 70.9,78.48 69.03,78.48 ; CN6.1 62.47,89.37 63.74,88.1
SPI_MOSI_PIN: length 21.5
  Top Layer w0.254: H2.4 59.47,88.49 59.47,90.72 ; 58.91,87.9 58.91,86.1 59.35,85.66 69.56,85.66 70.4,84.83 70.4,81.75 69.74,81.1 U1.57
SPI_MOSO_PIN: length 18.3
  Top Layer w0.254: 60.93,87.9 60.97,87.94 CN6.2
  Bottom Layer w0.254: 61.61,87.58 61.61,86.34 62.02,85.94 67.25,85.94 67.81,85.38 67.81,79.83 U1.55
SPI_SCK_PIN: length 33
  Top Layer w0.254: 56.6,87.96 57.97,89.33 CN6.4
  Bottom Layer w0.254: H2.3 57.75,89.31 70.14,89.31 70.91,88.53 70.91,76.57 70.42,76.08 69.09,76.08
TFT_BL: length 76.7
  Top Layer w0.152: v1(58.11,76.65) 58.11,77.69 60.1,79.68 60.1,81.66 60.84,82.4 63.02,82.4 63.99,83.37
  Inner2 w0.152: H6.16 24.68,36.86 24.68,49.5 26.99,51.81 41.48,51.81 43.8,54.12 43.8,58.01 47.06,61.27 50.95,61.27 53.24,63.56 53.24,69.08 58.12,73.96 58.12,76.64
TFT_CS: length 77.5
  Top Layer w0.152: v1(58.86,77.26) 58.86,77.28 60.61,79.03 64.52,79.03 65.21,79.72 65.21,82.15 66.54,83.48
  Inner2 w0.152: H6.14 27.15,36.8 27.15,49.92 28.64,51.41 42.37,51.41 44.58,53.62 44.58,58.06 47.34,60.82 51.55,60.82 53.95,63.22 53.95,68.59 58.87,73.5 58.87,77.25 arc(58.87,77.26) v1(58.86,77.26)
TFT_DC: length 78.5
  Top Layer w0.152: v1(59.72,76.62) 59.72,76.63 60.36,77.27 67.28,77.27 67.8,77.79 67.8,82.46 68.97,83.62
  Inner2 w0.152: H6.12 29.75,36.85 29.75,49.87 30.86,50.98 43.02,50.98 45.33,53.29 45.33,58.06 47.63,60.36 51.97,60.36 54.58,62.97 54.58,68.22 59.59,73.23 59.59,76.31 arc(59.63,76.48) v1(59.72,76.62)
TFT_RES: length 74.1
  Inner2 w0.152: 66.61,81.1 66.07,81.1 64.91,82.27 60.66,82.27 60.12,81.72 60.12,79.4 60.55,78.97 60.55,73.16 55.12,67.72 55.12,62.51 52.49,59.88 47.94,59.88 46.07,58.01 46.07,52.87 43.78,50.58 34.07,50.58 32.29,48.8 32.29,36.85 H6.10
TFT_SCL: length 66.6
  Inner2 w0.152: H6.6 37.38,36.87 37.38,48.64 38.45,49.71 45.36,49.71 47.42,51.77 47.42,57.85 48.42,58.85 57.85,58.85 58.81,59.81 58.81,62.36 63.94,67.49 63.94,81.09
TFT_SDA: length 64.4
  Inner2 w0.152: 61.51,80.87 61.51,73.07 55.71,67.26 55.71,62.17 52.86,59.32 48.14,59.32 46.76,57.95 46.76,52.27 44.62,50.12 36.46,50.12 34.8,48.47 34.8,36.83 H6.8
TX_3: length 122.3
  Top Layer w0.254: v1(83.92,19.9) 83.27,19.25 30.35,19.25 29.41,20.19
  Bottom Layer w0.254: v1(83.92,19.9) 83.92,43.65 81.93,45.64 81.93,53.26 83.17,54.5 83.17,59.85 81.96,61.06 74.81,61.06 73.57,62.31 73.57,72.76 72.85,73.48 U1.52
$1N5105: length 16.6
  Top Layer w0.762: 47.97,55.99 48.05,55.99 arc(49.26,56.49) C10.2
  Top Layer w1.016: 51.71,58.16 51.25,57.7 C10.2 49.76,56.57 48.62,55.42
  Top Layer w1.524: 52.07,58.86 52.07,58.29 ; 52.07,58.86 52.07,60.91 ; 52.07,58.86 arc(52.65,60.26) 54.05,60.84 ; 55.31,60.84 54.05,60.84 ; 54.05,60.84 52.17,60.84 52.14,60.87
$1N7239: length 3.3
  Top Layer w0.254: 29.33,91.3 30.11,91.3 30.4,91.01 30.4,89.33 R5.2
$1N7534: length 2.8
  Top Layer w0.381: R6.2 70.14,90.89 72.58,90.89
$1N8911: length 2.5
  Top Layer w0.381: 10.94,46.42 10.94,44.96 LED2.1
$1N19288: length 2.5
  Top Layer w0.381: LED1.1 14.56,45.02 14.56,46.23
$1N37513: length 4.9
  Top Layer w0.381: U7.1 35.13,71.28 35.38,71.53 36.92,71.53 37.17,71.28 37.17,69.9
$1N37517: length 5.4
  Top Layer w0.254: 29,68.44 31,68.44 31.32,68.76 U7.4 ; 29,68.44 R8.1 ; 29,68.44 29,67.65 28.98,67.63
$1N40288: length 4.3
  Top Layer w0.381: 38.47,52.69 39.35,52.69 39.66,52.38 39.66,50.91 39.42,50.67 C4.2
$1N40290: length 1.4
  Top Layer w0.254: 42.11,50.24 42.11,50.24 arc(41.99,49.95) 41.7,49.84 40.94,49.84
$1N49327: length 4.8
  Top Layer w0.254: 38.12,56.5 36.92,56.5 36.65,56.78 36.65,58.33 ; R10.2 36.65,58.33 ; 36.65,58.33 37.5,58.33 37.53,58.3
$2N23716: length 5.5
  Top Layer w0.152: R14.1 R13.2
  Top Layer w0.203: R19.2 arc(47.07,73.95) 47.7,73.21
$2N31818: length 29.8
  Top Layer w0.254: R1.2 62.7,60.71
  Bottom Layer w0.152: v1(61.94,59.83) 61.94,55.84 arc(62.09,55.49) 62.45,55.34 74.88,55.34 arc(75.19,55.47) 75.32,55.79 75.32,57.22 arc(75.46,57.54) 75.78,57.67 81.58,57.67 arc(81.86,57.56) 81.98,57.27 81.98,56.25
$2N31849: length 19.1
  Top Layer w0.254: R7.2 62.72,54.9
  Bottom Layer w0.152: 76.92,56.3 76.92,54.94 arc(76.8,54.66) 76.52,54.55 62.48,54.55 arc(62.12,54.39) v1(61.96,54.03)
$2N44868: length 6.6
  Top Layer w0.254: 46.91,32.31 46.91,34.94 R18.2 ; 46.91,32.18 45.15,32.18 C30.2 ; R17.2 46.87,34.96 46.88,34.95
$2N44874: length 18.3
  Top Layer w0.254: 51.35,31.87 50.75,31.27 Q1.3 ; C15.1 51.5,31.97 51.5,34.18
  Bottom Layer w0.254: BUZZER1.2 57.38,32.5 56.8,33.08 51.53,33.08 v1(51.49,33.04)
$2N61034: length 19.3
  Inner2 w0.254: 59,83.55 arc(58.67,82.76) 57.88,82.43 42.48,82.43 arc(41.54,82.04) U1.79
$3N519: length 4.1
  Top Layer w0.254: R30.2 81.07,62.83
$3N520: length 3.5
  Top Layer w0.254: R27.2 81.55,64.32
$3N521: length 4
  Top Layer w0.254: R26.2 82.03,65.86

## Copper pours and planes (outline as drawn; the poured copper is in the pictures)
+5V on Top Layer: 43.28,66.94 56.09,66.94 56.09,65.57 43.28,65.57
+5V on Top Layer: 41.98,69.35 44.44,69.35 44.44,54.96 41.98,54.96
+5V on Inner2: 42.36,69.38 44.81,69.38 44.81,64.03 42.36,64.03
GND on Top Layer: 32.48,57.71 38.13,57.71 38.13,52.07 32.48,52.07
GND on Top Layer: 27.32,70.14 40.16,70.14 40.16,60.61 27.32,60.61
GND on Inner1: -6.92,102.74 96.12,102.74 96.12,-4.42 -6.92,-4.42
VCC on Top Layer: 27.71,65.6 34.28,65.6 34.28,61.18 27.71,61.18
VCC on Top Layer: 27.5,54.73 33.74,54.73 33.74,53.47 27.5,53.47
VCC on Bottom Layer: 1.54,63.08 18.02,63.08 18.02,41.39 1.54,41.39
VCC on Inner2: 1.54,63.48 18.02,63.48 18.02,41.39 1.54,41.39
BAT on Bottom Layer: 1.47,83.83 12.43,83.83 12.43,56.88 1.47,56.88
BAT on Inner2: 1.47,83.83 12.43,83.83 12.43,56.88 1.47,56.88
$1N37515 on Top Layer: 34.7,76.95 40.03,76.95 40.03,63.38 34.7,63.38
$1N40290 on Top Layer: 31.43,53.13 45.28,53.13 45.28,47.99 31.43,47.99

Small or netless copper shapes (teardrops, artwork), in the pictures only: 252 on Top Layer, 95 on Bottom Layer, 1 on Inner1, 69 on Inner2

## Text on the board
Top Silkscreen Layer: 4.7k | UART3 | UART0 | GND | 5V | 3V3 | + / T / R / - / x / x | x / + / - / T / R / x | UART2 | UART1 | + / - / T / R | - / R / T / + | BAT | 6V | V1.2.1 | P2.6 | P2.5 | P2.4 | P2.3 | P2.2 | 11.6 | GPS1 | 20.3 | 20.0 | GPS2 | 蜂鸣器 | 霍尔 | 编码器 | 棕 / 红 / 黄 | deng | 陀螺仪 | 驱动信号 | 舵机 | 5V / 电源 | 舵机 / 电源 | 5V GPS | 3V3 / 电源
